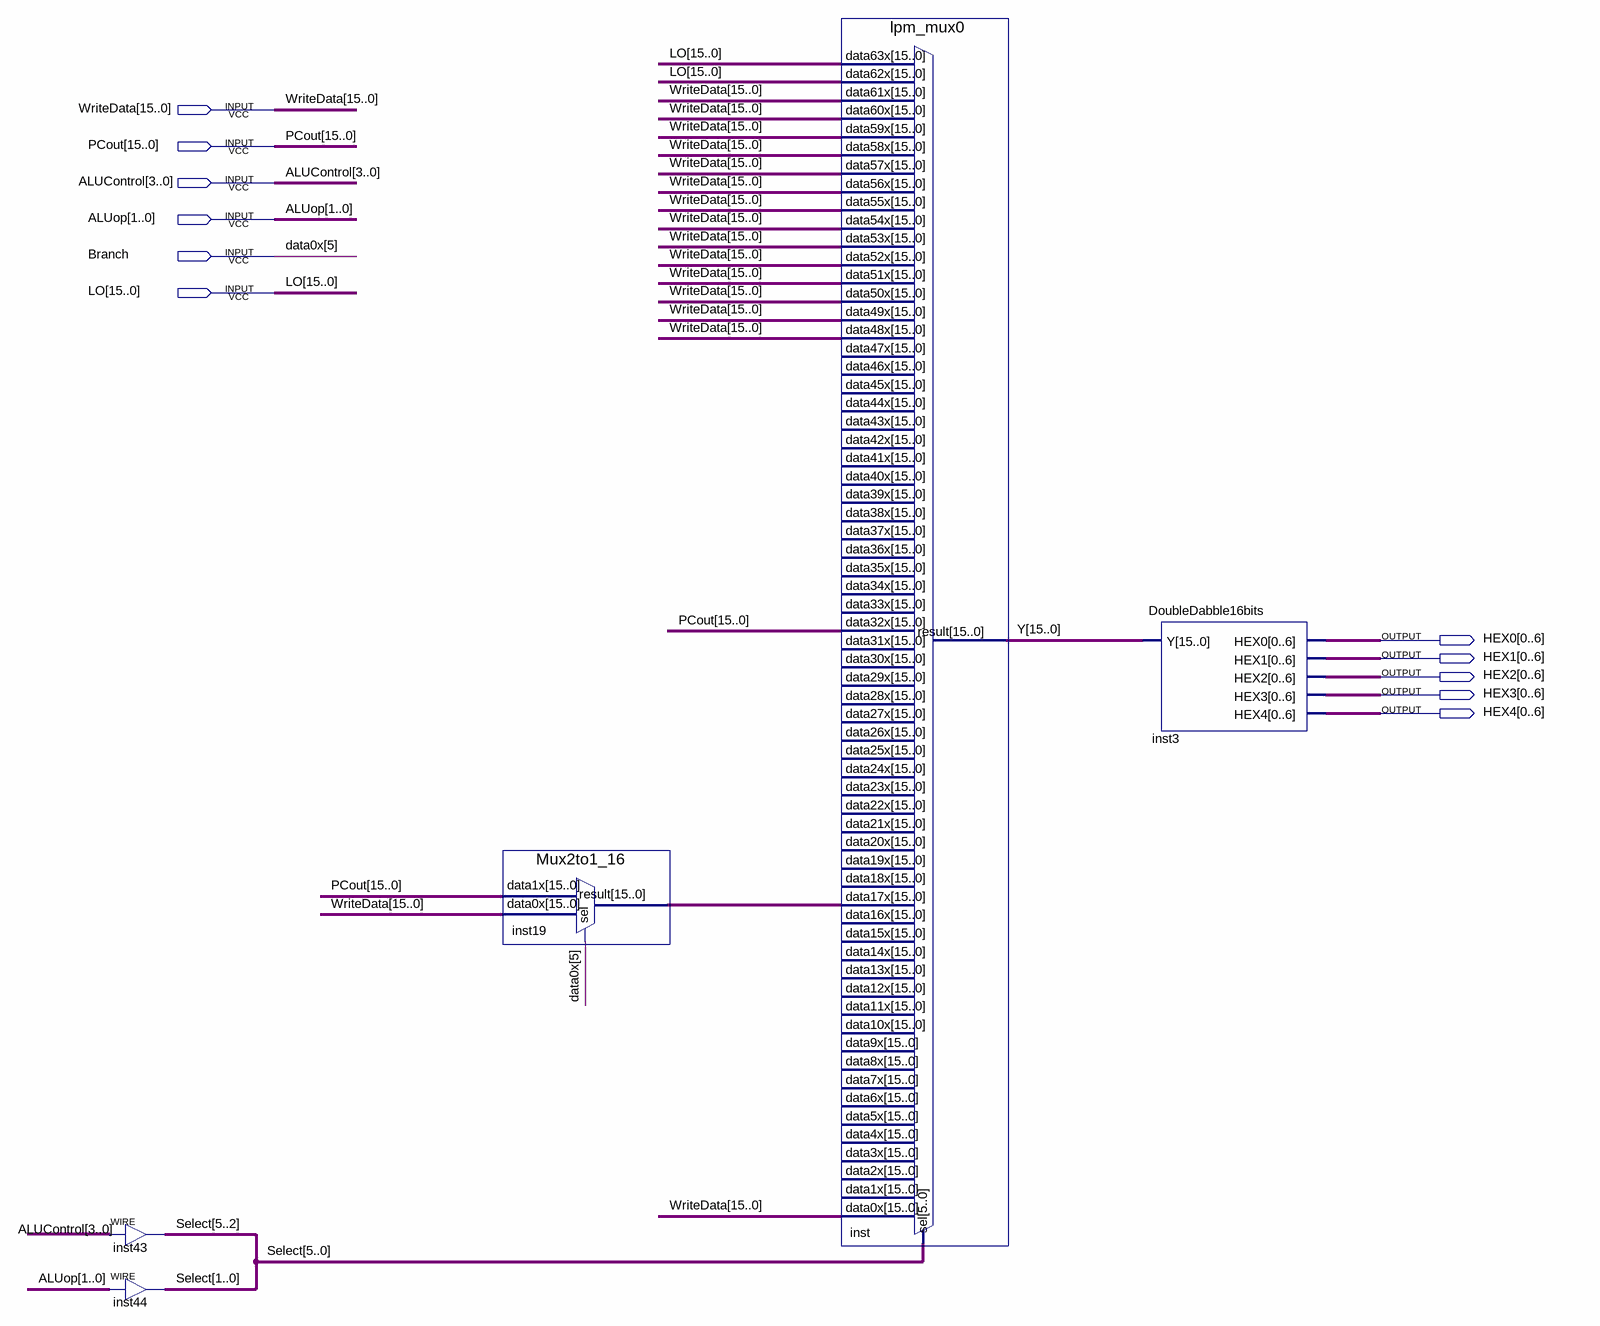
[diagram p0: schematic sheet]
// Quartus schematic Choutput.bdf as structural Verilog: 5 symbols, 11 pins
module Choutput (
  input  [15:0] WriteData,
  input  [15:0] PCout,
  input  [3:0] ALUControl,
  input  [1:0] ALUop,
  input  Branch,
  input  [15:0] LO,
  output [0:6] HEX0,
  output [0:6] HEX1,
  output [0:6] HEX2,
  output [0:6] HEX3,
  output [0:6] HEX4
);

  wire [5:0] Select;
  wire [15:0] inst19_result, Y;

  assign Select[5:2] = ALUControl;  // WIRE inst43
  assign Select[1:0] = ALUop;  // WIRE inst44
  Mux2to1_16 inst19 (.data1x(PCout), .data0x(WriteData), .sel(Branch), .result(inst19_result));
  lpm_mux0 inst (
    .data63x(LO), .data62x(LO), .data61x(WriteData), .data60x(WriteData), .data59x(WriteData),
    .data58x(WriteData), .data57x(WriteData), .data56x(WriteData), .data55x(WriteData), .data54x(WriteData),
    .data53x(WriteData), .data52x(WriteData), .data51x(WriteData), .data50x(WriteData), .data49x(WriteData),
    .data48x(WriteData), .data32x(PCout), .data17x(inst19_result), .data0x(WriteData), .sel(Select),
    .result(Y));  // open: data47x, data46x, data45x, data44x, data43x, data42x, data41x, data40x, data39x, data38x, data37x, data36x, data35x, data34x, data33x, data31x, data30x, data29x, data28x, data27x, data26x, data25x, data24x, data23x, data22x, data21x, data20x, data19x, data18x, data16x, data15x, data14x, data13x, data12x, data11x, data10x, data9x, data8x, data7x, data6x, data5x, data4x, data3x, data2x, data1x
  DoubleDabble16bits inst3 (.Y(Y), .HEX0(HEX0), .HEX1(HEX1), .HEX2(HEX2), .HEX3(HEX3), .HEX4(HEX4));

  // Other names for the same wires on the sheet: data0x[5] = Branch
endmodule
